# Altium project RaspberryPi3_Cape_V1.0.PrjPcb
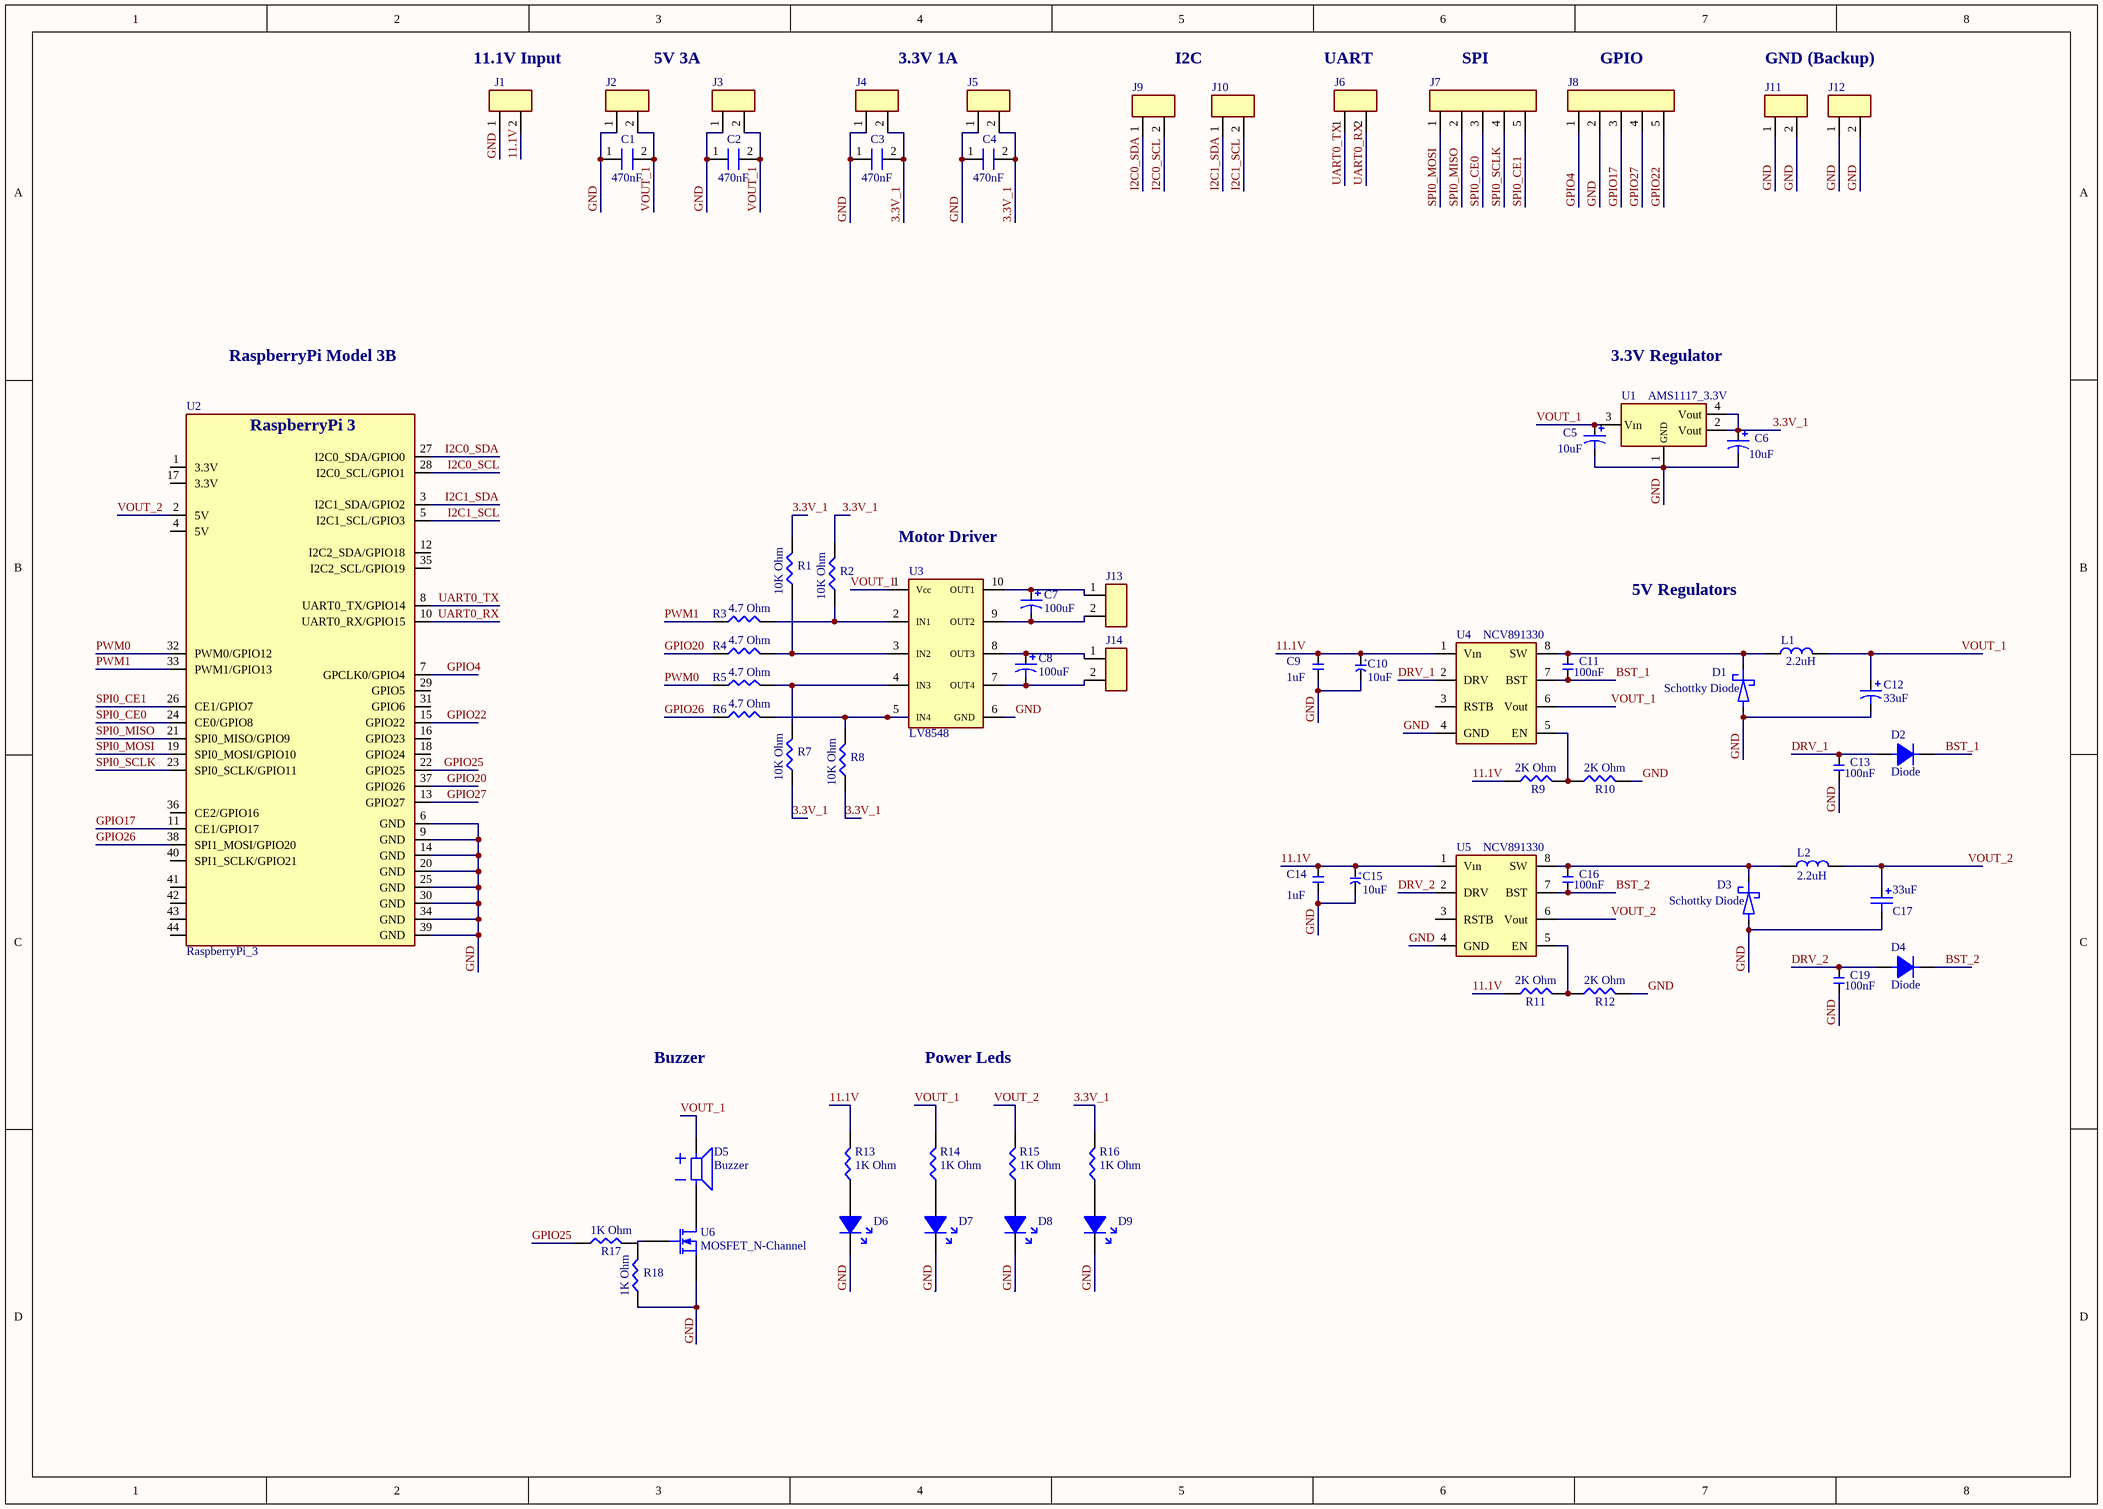
[diagram p0: RaspberryPi3_Cape_V1.0.SchDoc]
Checked_By: Efe KIRAZ; Company_: © 2020 DEU Dokuz Eylul Hava Araclarý; Drawn_By: Oguz Furkan AKYUZ; Project_Name: PowerTriggerBoard_RaspberrPi3-ModelB; Version: V1.0
1 sheet, 67 parts. Net scope: global (net labels, ports and power ports of the same name join across sheets).
Board file: RaspberryPi3_Cape_V1.0.PcbDoc

## Sheet RaspberryPi3_Cape_V1.0.SchDoc
size A3; DocumentNumber: 1; SheetNumber: 1; SheetTotal: 1; Size: A3

### Parts
C1  470nF  [CAP_0805]
C2  470nF  [CAP_0805]
C3  470nF  [CAP_0805]
C4  470nF  [CAP_0805]
C5  10uF  [CAP_POL_P-1.5mm]
C6  10uF  [CAP_POL_P-1.5mm]
C7  100uF  [Cap_Pol_P-2mm]
C8  100uF  [Cap_Pol_P-2mm]
C9  1uF  [CAP_0805]
C10  10uF  [CP_Radial_D5mm_L11mm_P2mm]
C11  100nF  [CAP_0805]
C12  33uF  [Cap_Pol_P-2mm]
C13  100nF  [CAP_0805]
C14  1uF  [CAP_0805]
C15  10uF  [CP_Radial_D5mm_L11mm_P2mm]
C16  100nF  [CAP_0805]
C17  33uF  [SMD_Electrolytic_6.3x5.2]
C19  100nF  [CAP_0805]
D1  Schottky Diode  [Schotty Diode]
D2  Diode  [SOD323]
D3  Schottky Diode  [Schotty Diode]
D4  Diode  [SOD323]
D5  Buzzer  [BUZZER]
D6  LED  [Led_0805]  (value not drawn)
D7  LED  [Led_0805]  (value not drawn)
D8  LED  [Led_0805]  (value not drawn)
D9  LED  [Led_0805]  (value not drawn)
J1  JST_1x2_2.54mm  [JST_1x2_B2B_XH-A]  (value not drawn)
J2  JST_1x2_2.54mm  [JST_1x2_B2B_XH-A]  (value not drawn)
J3  JST_1x2_2.54mm  [JST_1x2_B2B_XH-A]  (value not drawn)
J4  JST_1x2_2.54mm  [JST_1x2_B2B_XH-A]  (value not drawn)
J5  JST_1x2_2.54mm  [JST_1x2_B2B_XH-A]  (value not drawn)
J6  JST_1x2_2.54mm  [JST_1x2_B2B_XH-A]  (value not drawn)
J7  JST_1x5_2.54mm  [JST_1x5_B2B_XH-A]  (value not drawn)
J8  JST_1x5_2.54mm  [JST_1x5_B2B_XH-A]  (value not drawn)
J9  JST_1x2_2.54mm  [JST_1x2_B2B_XH-A]  (value not drawn)
J10  JST_1x2_2.54mm  [JST_1x2_B2B_XH-A]  (value not drawn)
J11  JST_1x2_2.54mm  [JST_1x2_B2B_XH-A]  (value not drawn)
J12  JST_1x2_2.54mm  [JST_1x2_B2B_XH-A]  (value not drawn)
J13  JST_1x2_2.54mm  [JST_1x2_B2B_XH-A]  (value not drawn)
J14  JST_1x2_2.54mm  [JST_1x2_B2B_XH-A]  (value not drawn)
L1  2.2uH  [INDUCTOR]
L2  2.2uH  [INDUCTOR]
R1  10K Ohm  [RES_0805_2012]
R2  10K Ohm  [RES_0805_2012]
R3  4.7 Ohm  [RES_0805_2012]
R4  4.7 Ohm  [RES_0805_2012]
R5  4.7 Ohm  [RES_0805_2012]
R6  4.7 Ohm  [RES_0805_2012]
R7  10K Ohm  [RES_0805_2012]
R8  10K Ohm  [RES_0805_2012]
R9  2K Ohm  [RES_0805_2012]
R10  2K Ohm  [RES_0805_2012]
R11  2K Ohm  [RES_0805_2012]
R12  2K Ohm  [RES_0805_2012]
R13  1K Ohm  [RES_0805_2012]
R14  1K Ohm  [RES_0805_2012]
R15  1K Ohm  [RES_0805_2012]
R16  1K Ohm  [RES_0805_2012]
R17  1K Ohm  [RES_0805_2012]
R18  1K Ohm  [RES_0805_2012]
U1  AMS1117_3.3V  [SOT223_AMS]
U2  RaspberryPi_3  [Raspberry Pi 3 ModelB]
U3  LV8548  [SOIC10]
U4  NCV891330  [SOIC8]
U5  NCV891330  [SOIC8]
U6  MOSFET_N-Channel  [SOT23]

### Nets
3.3V_1: C3.2 C4.2 C6.1 J4.2 J5.2 R1.2 R2.2 R7.1 R8.1 R16.2 U1.2(Vout) U1.4(Vout)
11.1V: C9.2 C10.1 C14.2 C15.1 J1.2 R9.1 R11.1 R13.2 U4.1(Vın) U5.1(Vın)
BST_1: C11.1 D2.2 U4.7(BST)
BST_2: C16.1 D4.2 U5.7(BST)
DRV_1: C13.2 D2.1 U4.2(DRV)
DRV_2: C19.2 D4.1 U5.2(DRV)
GND: C1.1 C2.1 C3.1 C4.1 C5.2 C6.2 C9.1 C10.2 C12.2 C13.1 C14.1 C15.2 C17.2 C19.1 D1.1 D3.1 D6.2 D7.2 D8.2 D9.2 J1.1 J2.1 J3.1 J4.1 J5.1 J8.2 J11.1 J11.2 J12.1 J12.2 R10.2 R12.2 U1.1(GND) U2.6(GND) U2.9(GND) U2.14(GND) U2.20(GND) U2.25(GND) U2.30(GND) U2.34(GND) U2.39(GND) U3.6(GND) U4.4(GND) U5.4(GND)
GPIO4: J8.1 U2.7(GPCLK0/GPIO4)
GPIO17: J8.3 U2.11(CE1/GPIO17)
GPIO20: R4.1 U2.37(GPIO26)
GPIO22: J8.5 U2.15(GPIO22)
GPIO25: R17.1 U2.22(GPIO25)
GPIO26: R6.1 U2.38(SPI1_MOSI/GPIO20)
GPIO27: J8.4 U2.13(GPIO27)
I2C0_SCL: J9.2 U2.28(I2C0_SCL/GPIO1)
I2C0_SDA: J9.1 U2.27(I2C0_SDA/GPIO0)
I2C1_SCL: J10.2 U2.5(I2C1_SCL/GPIO3)
I2C1_SDA: J10.1 U2.3(I2C1_SDA/GPIO2)
PWM0: R5.1 U2.32(PWM0/GPIO12)
PWM1: R3.1 U2.33(PWM1/GPIO13)
SPI0_CE0: J7.3 U2.24(CE0/GPIO8)
SPI0_CE1: J7.5 U2.26(CE1/GPIO7)
SPI0_MISO: J7.2 U2.21(SPI0_MISO/GPIO9)
SPI0_MOSI: J7.1 U2.19(SPI0_MOSI/GPIO10)
SPI0_SCLK: J7.4 U2.23(SPI0_SCLK/GPIO11)
UART0_RX: J6.2 U2.10(UART0_RX/GPIO15)
UART0_TX: J6.1 U2.8(UART0_TX/GPIO14)
VOUT_1: C1.2 C2.2 C5.1 C12.1 D5.1 J2.2 J3.2 L1.2 R14.2 U1.3(Vın) U3.1(Vcc) U4.6(Vout)
VOUT_2: C17.1 L2.2 R15.2 U2.2(5V) U5.6(Vout)
NetC7_1: C7.1 J13.1 U3.10(OUT1)
NetC7_2: C7.2 J13.2 U3.9(OUT2)
NetC8_1: C8.1 J14.1 U3.8(OUT3)
NetC8_2: C8.2 J14.2 U3.7(OUT4)
NetC11_2: C11.2 D1.2 L1.1 U4.8(SW)
NetC16_2: C16.2 D3.2 L2.1 U5.8(SW)
NetD5_2: D5.2 U6.3(D)
NetD6_1: D6.1 R13.1
NetD7_1: D7.1 R14.1
NetD8_1: D8.1 R15.1
NetD9_1: D9.1 R16.1
NetR1_1: R1.1 R4.2 U3.3(IN2)
NetR2_1: R2.1 R3.2 U3.2(IN1)
NetR5_2: R5.2 R7.2 U3.4(IN3)
NetR6_2: R6.2 R8.2 U3.5(IN4)
NetR9_2: R9.2 R10.1 U4.5(EN)
NetR11_2: R11.2 R12.1 U5.5(EN)
NetR17_2: R17.2 R18.2 U6.1(G)
NetR18_1: R18.1 U6.2(S)

Not connected (* = marked no-connect by the designer): U2 1(3.3V) 4(5V) 12(I2C2_SDA/GPIO18) 16(GPIO23) 17(3.3V) 18(GPIO24) 29(GPIO5) 31(GPIO6) 35(I2C2_SCL/GPIO19) 36(CE2/GPIO16) 40(SPI1_SCLK/GPIO21) 41 42 43 44; U4 3(RSTB); U5 3(RSTB)

### Notes on the sheet
- 11.1V Input
- 5V 3A
- 3.3V 1A
- I2C
- (near J6) UART
- (near J7) SPI
- (near J8) GPIO
- GND (Backup)
- RaspberryPi Model 3B
- 3.3V Regulator
- Motor Driver
- 5V Regulators
- Buzzer
- Power Leds
- Labels drawn without touching a wire or pin: GND
- (in symbol Cap_Pol_4x6) +
- (in symbol RaspberryPi_3) RaspberryPi 3

### Library data of the parts
C1-C4 C9 C11 C13 C14 C16 C19 = CAP_0805: 0805 Package SMD Capacitor
C5 C6 = Cap_Polarized_1.5mm
C7 C8 C12 = Cap_Polarized: Polarized Capacitor 2.5mm pitch
C10 C15 = Cap_Pol_4x6: 4x6 Radial Polarized Capacitor
C17 = CAP_SMD_Electrolytic_6.3x5.4
D1 D3 = Schottky Diode: 1A,60V Schottky Diode
D2 D4 = Diode: SOD323 Package Diode.
D6-D9 = LED_0805_2012: 0805 Package SMD Led
J1-J6 J9-J14 = JST_1x2_2.54mm: JST_1x2_2.54mm PCB Header
J7 J8 = JST_1x5_2.54mm: JST_1x5_2.54mm PCB Header
L1 L2 = Inductor
R1-R18 = RES_0805_2012: 0805 Package SMD Resistor
U1 = AMS1117_3.3V: Linear Regulator.         3.3V,1A Output.                        SOT-223 Package.
U2 = RaspberryPi_3: RaspberryPi 3+ Model B.
U3 = LV8548: 2-Channel Motor Driver.           SOIC-10 Package.
U4 U5 = NCV891330: Switching Regulator.            5V, Max 3A Output.                         SOIC-8 Package.
U6 = MOSFET_N-Channel: 500mA,60V N-Channel Mosfet.